# EAGLE design DS1624S_termometr_minibord (EAGLE 6.3)
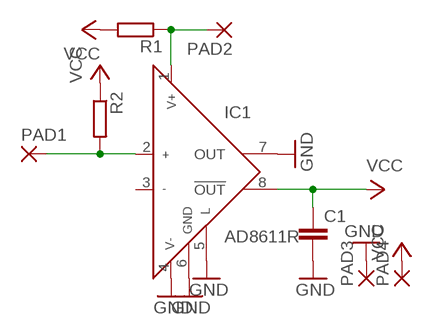
[diagram p0: schematic, sheet 1]

## Parts
C1  C-EUC0805  [C0805]
IC1  AD8611R  [SO8]
PAD1  1,6/0,8  [1,6/0,8]
PAD2  1,6/0,8  [1,6/0,8]
PAD3  1,6/0,8  [1,6/0,8]
PAD4  1,6/0,8  [1,6/0,8]
R1  R-EU_M0805  [M0805]
R2  R-EU_M0805  [M0805]

## Nets
GND: C1.2 IC1.4(V-) IC1.5(L) IC1.6(GND) IC1.7(OUT) PAD3.1(P)
N$1: IC1.2(IN+) PAD1.1(P) R2.2
N$2: IC1.1(V+) PAD2.1(P) R1.1
VCC: C1.1 IC1.8(!OUT) PAD4.1(P) R1.2 R2.1
Unconnected: IC1.3(IN-)

## Library data of the parts
C1 = rcl:C-EU: CAPACITOR, European symbol
IC1 = analog-devices:AD8611: Ultrafast 4 ns Single Supply Comparators Source: http://www.analog.com/UploadedFiles/Data_Sheets/703465986AD8611_2_0.pdf Upgrade for LT1394 and LT1016 Designs; MPN: AD8611ARMZ-R2; OC_FARNELL: 1319472; OC_NEWARK: 19M8930
PAD1-PAD4 = wirepad:1,6/0,8: THROUGH-HOLE PAD
R1 R2 = resistor:R-EU_: RESISTOR, European symbol

## Net classes
0 default: clearance 0.7 mm

## Board
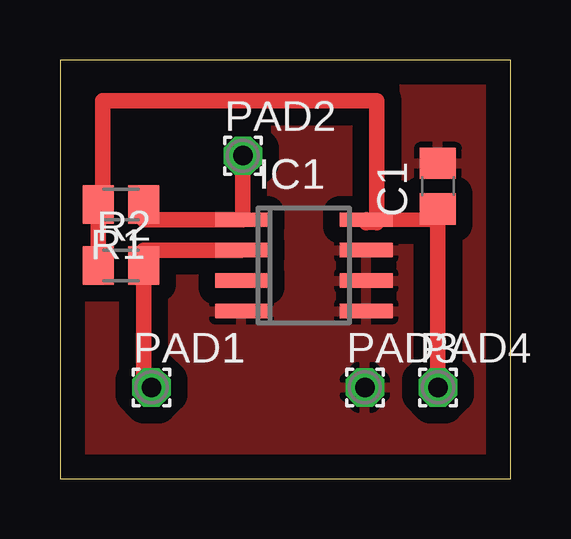
[diagram p1: board, top side]

Size 18.78 x 17.45 mm. Coordinates in mm from the lower left corner, seen from the top.
Outline: 0,0 18.78,0 18.78,17.45 0,17.45 0,0
Copper layers (1*16): Top 0.035mm / dielectric 1.5mm / Bottom 0.035mm
Design rules "default": minimum track width 10mil, minimum drill 24mil, track to track 8mil, track to pad 8mil, pad to pad 8mil, via to via 8mil, smd to smd 8mil, copper to edge 40mil, drill to drill 8mil, minimum pad ring 10mil, minimum via ring 8mil, stop-mask expansion 4mil, vias tented up to drill 0mil, thermal gap 10mil

### Footprints (pad centres in the part's own frame; a part is rotated, then mirrored left to right if it is on the bottom)
C0805 = smd 1.3 x 1.5: 1 -0.95,0; 2 0.95,0
SO8 = smd 0.6 x 2.2: 1 -1.905,-2.6; 2 -0.635,-2.6; 3 0.635,-2.6; 4 1.905,-2.6; 5 1.905,2.6; 6 0.635,2.6; 7 -0.635,2.6; 8 -1.905,2.6
1,6/0,8 = drill 0.813 pad 1.6 octagon: 1 0,0
M0805 = smd 1.3 x 1.6: 1 -0.95,0; 2 0.95,0

### Placement (x,y rotation side)
C1  15.75,12.19 90 top
IC1  10.16,8.89 270 top
PAD1  3.81,3.81 0 top
PAD2  7.62,13.46 0 top
PAD3  12.7,3.81 0 top
PAD4  15.75,3.81 0 top
R1  2.54,11.43 180 top
R2  2.54,8.89 0 top

### Tracks (layer width: path | path; a pad name or v marks a point on that pad's centre or on a via)
GND
  pour Top: 0,0 24.13,0 24.13,17.78 0,17.78
N$1
  Top 0.65: PAD1.1 3.49,3.81 R2.2 3.49,9.53 IC1.2
N$2
  Top 0.65: R1.1 3.49,10.79 IC1.1 7.62,10.79 PAD2.1
VCC
  Top 0.6: IC1.8 15.75,10.79 | 13.21,10.67 12.76,10.67
  Top 0.65: C1.1 15.75,10.79 PAD4.1 | R2.1 R1.2 1.78,11.43 1.78,15.75 13.21,15.75 13.21,10.67 | 12.76,10.67 IC1.8